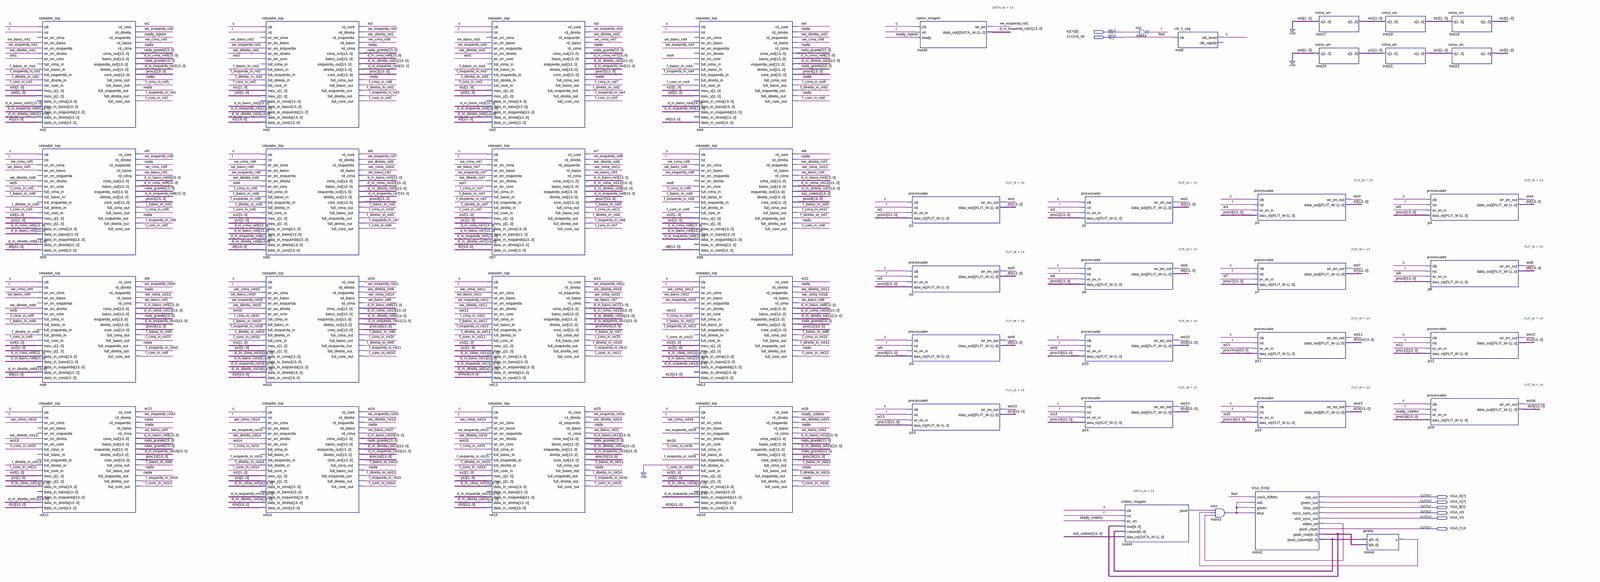
[diagram p0: schematic sheet, whole]
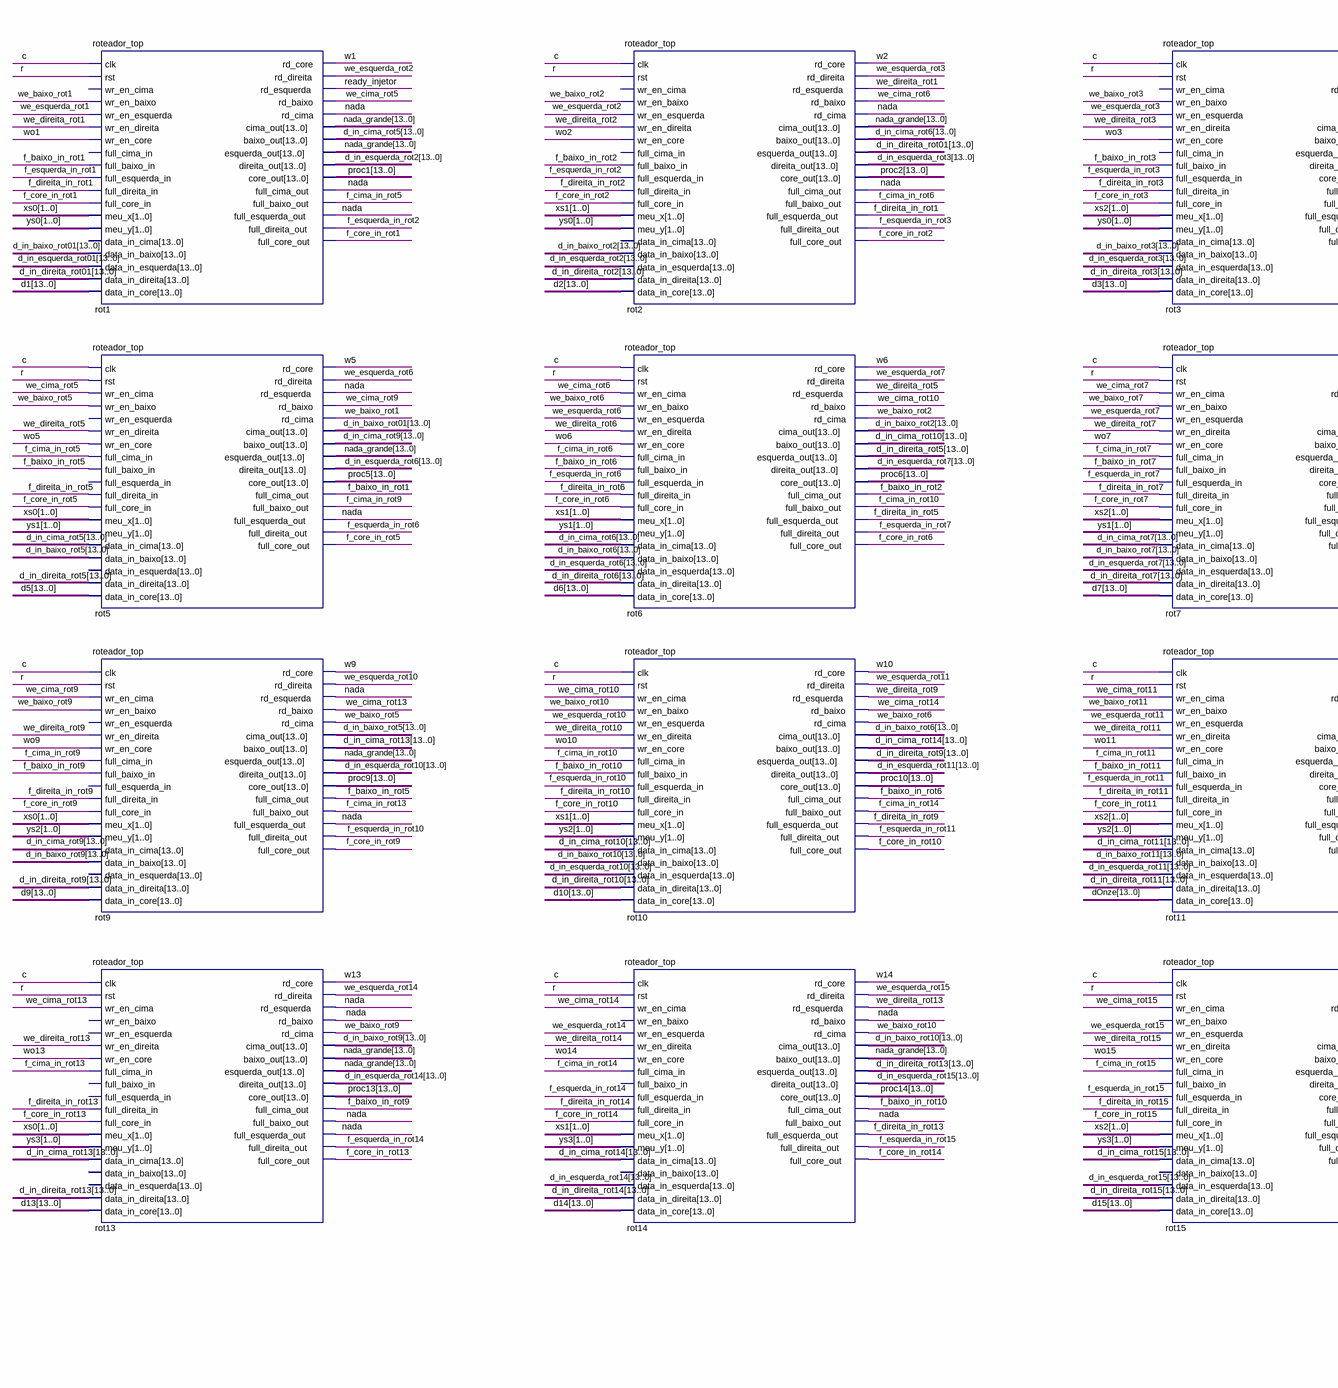
[diagram p1: schematic sheet, left part]
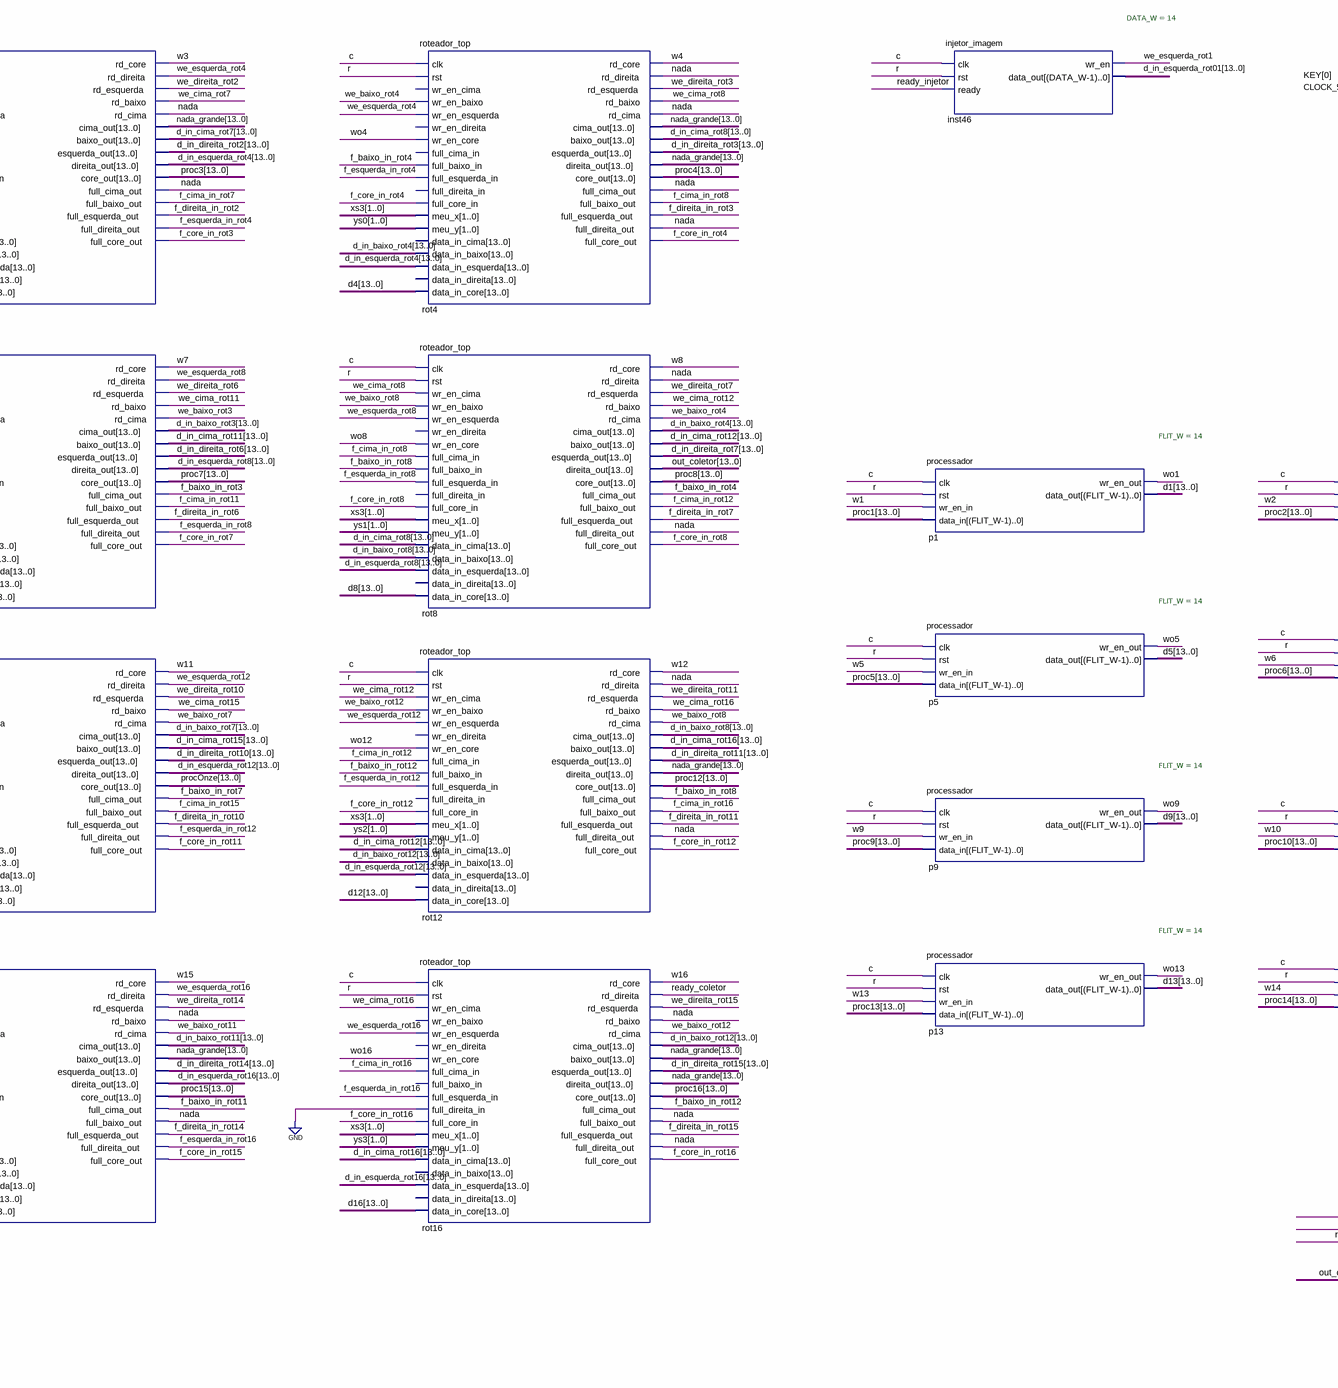
[diagram p2: schematic sheet, centre part]
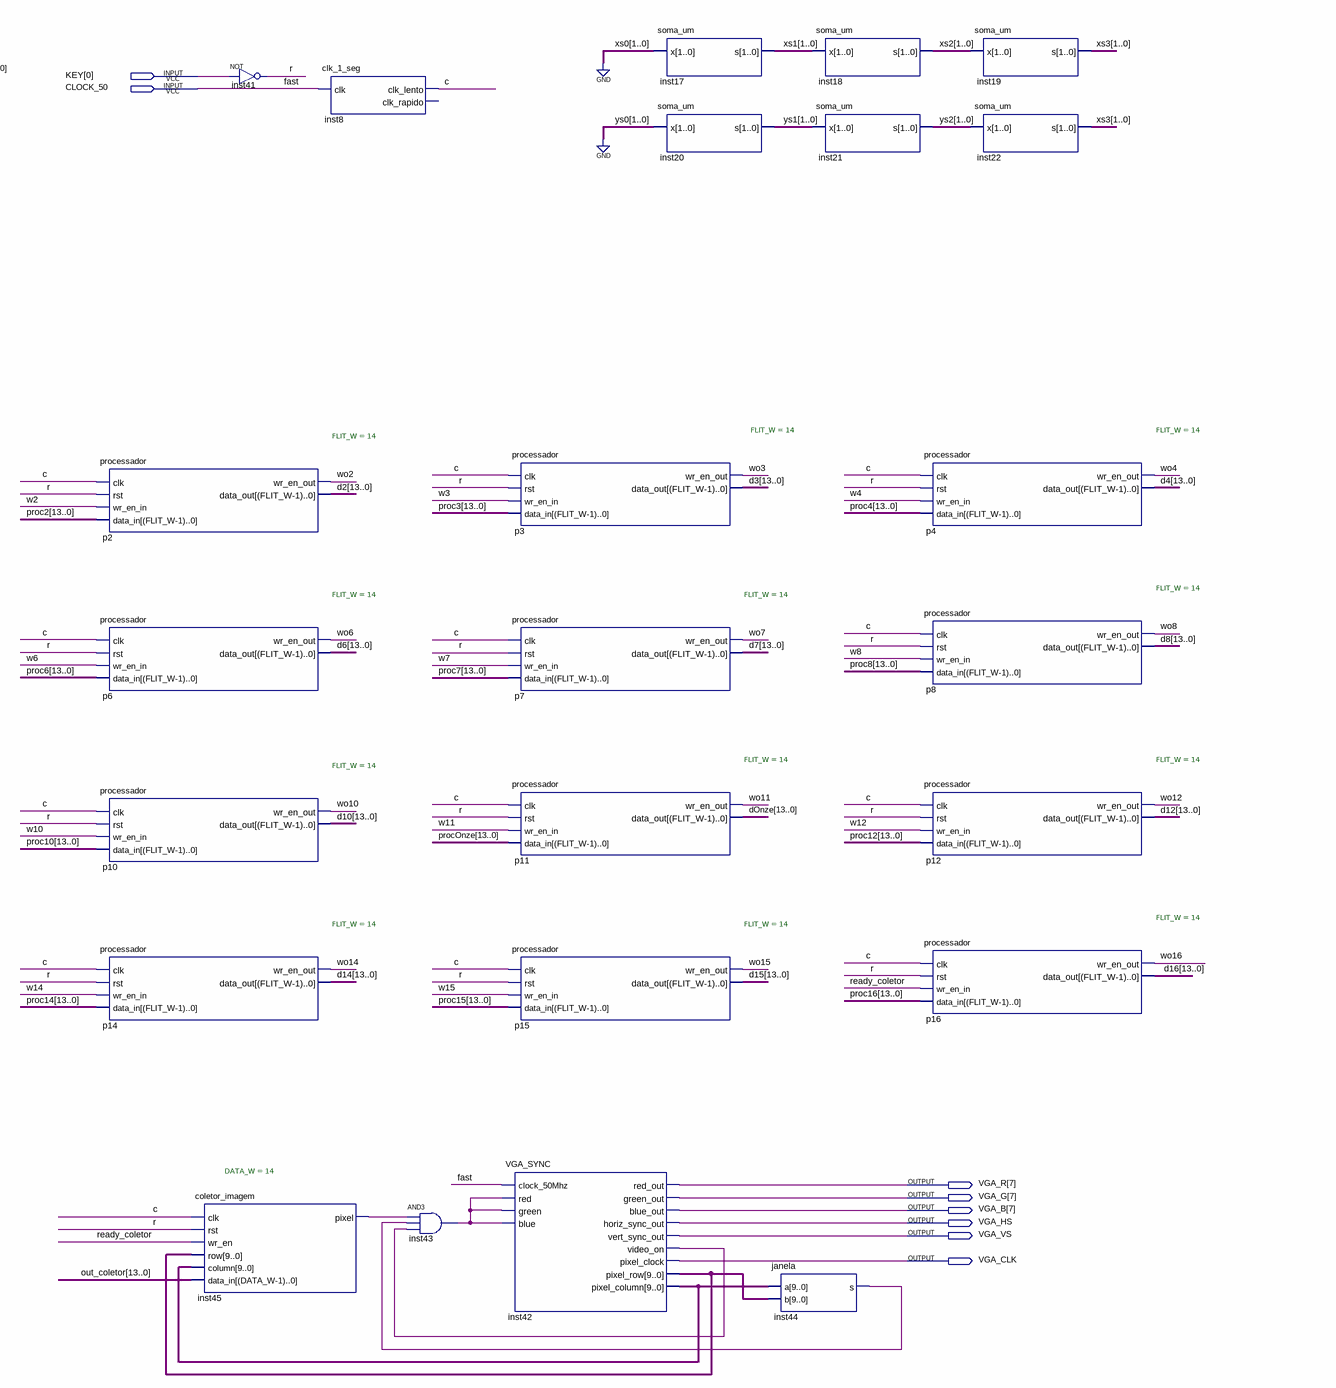
[diagram p3: schematic sheet, right part]
// Quartus schematic pratica05.bdf as structural Verilog: 45 symbols, 8 pins
module pratica05 (
  input  [0:0] KEY,
  input  CLOCK_50,
  output [7:7] VGA_R,
  output [7:7] VGA_G,
  output [7:7] VGA_B,
  output VGA_HS,
  output VGA_VS,
  output VGA_CLK
);

  wire c, f_baixo_in_rot1, f_baixo_in_rot2, f_baixo_in_rot3, f_baixo_in_rot4, f_baixo_in_rot5,
       f_baixo_in_rot6, f_baixo_in_rot7, f_baixo_in_rot8, f_baixo_in_rot9, f_baixo_in_rot10,
       f_baixo_in_rot11, f_baixo_in_rot12, f_cima_in_rot5, f_cima_in_rot6, f_cima_in_rot7, f_cima_in_rot8,
       f_cima_in_rot9, f_cima_in_rot10, f_cima_in_rot11, f_cima_in_rot12, f_cima_in_rot13, f_cima_in_rot14,
       f_cima_in_rot15, f_cima_in_rot16, f_core_in_rot1, f_core_in_rot2, f_core_in_rot3, f_core_in_rot4,
       f_core_in_rot5, f_core_in_rot6, f_core_in_rot7, f_core_in_rot8, f_core_in_rot9, f_core_in_rot10,
       f_core_in_rot11, f_core_in_rot12, f_core_in_rot13, f_core_in_rot14, f_core_in_rot15, f_core_in_rot16,
       f_direita_in_rot1, f_direita_in_rot2, f_direita_in_rot3, f_direita_in_rot5, f_direita_in_rot6,
       f_direita_in_rot7, f_direita_in_rot9, f_direita_in_rot10, f_direita_in_rot11, f_direita_in_rot13,
       f_direita_in_rot14, f_direita_in_rot15, f_esquerda_in_rot1, f_esquerda_in_rot2, f_esquerda_in_rot3,
       f_esquerda_in_rot4, f_esquerda_in_rot6, f_esquerda_in_rot7, f_esquerda_in_rot8, f_esquerda_in_rot10,
       f_esquerda_in_rot11, f_esquerda_in_rot12, f_esquerda_in_rot14, f_esquerda_in_rot15,
       f_esquerda_in_rot16, inst42_video_on, inst43_out, inst44_s, inst45_pixel, nada, r, ready_coletor,
       ready_injetor, w1, w2, w3, w4, w5, w6, w7, w8, w9, w10, w11, w12, w13, w14, w15, w16, we_baixo_rot1,
       we_baixo_rot2, we_baixo_rot3, we_baixo_rot4, we_baixo_rot5, we_baixo_rot6, we_baixo_rot7,
       we_baixo_rot8, we_baixo_rot9, we_baixo_rot10, we_baixo_rot11, we_baixo_rot12, we_cima_rot5,
       we_cima_rot6, we_cima_rot7, we_cima_rot8, we_cima_rot9, we_cima_rot10, we_cima_rot11, we_cima_rot12,
       we_cima_rot13, we_cima_rot14, we_cima_rot15, we_cima_rot16, we_direita_rot1, we_direita_rot2,
       we_direita_rot3, we_direita_rot5, we_direita_rot6, we_direita_rot7, we_direita_rot9, we_direita_rot10,
       we_direita_rot11, we_direita_rot13, we_direita_rot14, we_direita_rot15, we_esquerda_rot1,
       we_esquerda_rot2, we_esquerda_rot3, we_esquerda_rot4, we_esquerda_rot6, we_esquerda_rot7,
       we_esquerda_rot8, we_esquerda_rot10, we_esquerda_rot11, we_esquerda_rot12, we_esquerda_rot14,
       we_esquerda_rot15, we_esquerda_rot16, wo1, wo2, wo3, wo4, wo5, wo6, wo7, wo8, wo9, wo10, wo11, wo12,
       wo13, wo14, wo15, wo16;
  wire [1:0] xs1, xs2, xs3, ys1, ys2, ys3;
  wire [9:0] inst42_pixel_column, inst42_pixel_row;
  wire [13:0] d1, d2, d3, d4, d5, d6, d7, d8, d9, d10, d12, d13, d14, d15, d16, d_in_baixo_rot01,
       d_in_baixo_rot2, d_in_baixo_rot3, d_in_baixo_rot4, d_in_baixo_rot5, d_in_baixo_rot6, d_in_baixo_rot7,
       d_in_baixo_rot8, d_in_baixo_rot9, d_in_baixo_rot10, d_in_baixo_rot11, d_in_baixo_rot12,
       d_in_cima_rot5, d_in_cima_rot6, d_in_cima_rot7, d_in_cima_rot8, d_in_cima_rot9, d_in_cima_rot10,
       d_in_cima_rot11, d_in_cima_rot12, d_in_cima_rot13, d_in_cima_rot14, d_in_cima_rot15, d_in_cima_rot16,
       d_in_direita_rot01, d_in_direita_rot2, d_in_direita_rot3, d_in_direita_rot5, d_in_direita_rot6,
       d_in_direita_rot7, d_in_direita_rot9, d_in_direita_rot10, d_in_direita_rot11, d_in_direita_rot13,
       d_in_direita_rot14, d_in_direita_rot15, d_in_esquerda_rot01, d_in_esquerda_rot2, d_in_esquerda_rot3,
       d_in_esquerda_rot4, d_in_esquerda_rot6, d_in_esquerda_rot7, d_in_esquerda_rot8, d_in_esquerda_rot10,
       d_in_esquerda_rot11, d_in_esquerda_rot12, d_in_esquerda_rot14, d_in_esquerda_rot15,
       d_in_esquerda_rot16, dOnze, nada_grande, out_coletor, proc1, proc2, proc3, proc4, proc5, proc6, proc7,
       proc8, proc9, proc10, proc12, proc13, proc14, proc15, proc16, procOnze;

  roteador_top rot1 (
    .clk(c), .rst(r), .wr_en_baixo(we_baixo_rot1), .wr_en_esquerda(we_esquerda_rot1),
    .wr_en_direita(we_direita_rot1), .wr_en_core(wo1), .full_baixo_in(f_baixo_in_rot1),
    .full_esquerda_in(f_esquerda_in_rot1), .full_direita_in(f_direita_in_rot1),
    .full_core_in(f_core_in_rot1), .meu_x(2'b00), .meu_y(2'b00), .data_in_baixo(d_in_baixo_rot01),
    .data_in_esquerda(d_in_esquerda_rot01), .data_in_direita(d_in_direita_rot01), .data_in_core(d1),
    .rd_core(w1), .rd_direita(we_esquerda_rot2), .rd_esquerda(ready_injetor), .rd_baixo(we_cima_rot5),
    .rd_cima(nada), .cima_out(nada_grande), .baixo_out(d_in_cima_rot5), .esquerda_out(nada_grande),
    .direita_out(d_in_esquerda_rot2), .core_out(proc1), .full_cima_out(nada),
    .full_baixo_out(f_cima_in_rot5), .full_esquerda_out(nada), .full_direita_out(f_esquerda_in_rot2),
    .full_core_out(f_core_in_rot1));  // open: wr_en_cima, full_cima_in, data_in_cima
  roteador_top rot5 (
    .clk(c), .rst(r), .wr_en_cima(we_cima_rot5), .wr_en_baixo(we_baixo_rot5),
    .wr_en_direita(we_direita_rot5), .wr_en_core(wo5), .full_cima_in(f_cima_in_rot5),
    .full_baixo_in(f_baixo_in_rot5), .full_direita_in(f_direita_in_rot5), .full_core_in(f_core_in_rot5),
    .meu_x(2'b00), .meu_y(ys1), .data_in_cima(d_in_cima_rot5), .data_in_baixo(d_in_baixo_rot5),
    .data_in_direita(d_in_direita_rot5), .data_in_core(d5), .rd_core(w5), .rd_direita(we_esquerda_rot6),
    .rd_esquerda(nada), .rd_baixo(we_cima_rot9), .rd_cima(we_baixo_rot1), .cima_out(d_in_baixo_rot01),
    .baixo_out(d_in_cima_rot9), .esquerda_out(nada_grande), .direita_out(d_in_esquerda_rot6),
    .core_out(proc5), .full_cima_out(f_baixo_in_rot1), .full_baixo_out(f_cima_in_rot9),
    .full_esquerda_out(nada), .full_direita_out(f_esquerda_in_rot6), .full_core_out(f_core_in_rot5));  // open: wr_en_esquerda, full_esquerda_in, data_in_esquerda
  roteador_top rot9 (
    .clk(c), .rst(r), .wr_en_cima(we_cima_rot9), .wr_en_baixo(we_baixo_rot9),
    .wr_en_direita(we_direita_rot9), .wr_en_core(wo9), .full_cima_in(f_cima_in_rot9),
    .full_baixo_in(f_baixo_in_rot9), .full_direita_in(f_direita_in_rot9), .full_core_in(f_core_in_rot9),
    .meu_x(2'b00), .meu_y(ys2), .data_in_cima(d_in_cima_rot9), .data_in_baixo(d_in_baixo_rot9),
    .data_in_direita(d_in_direita_rot9), .data_in_core(d9), .rd_core(w9), .rd_direita(we_esquerda_rot10),
    .rd_esquerda(nada), .rd_baixo(we_cima_rot13), .rd_cima(we_baixo_rot5), .cima_out(d_in_baixo_rot5),
    .baixo_out(d_in_cima_rot13), .esquerda_out(nada_grande), .direita_out(d_in_esquerda_rot10),
    .core_out(proc9), .full_cima_out(f_baixo_in_rot5), .full_baixo_out(f_cima_in_rot13),
    .full_esquerda_out(nada), .full_direita_out(f_esquerda_in_rot10), .full_core_out(f_core_in_rot9));  // open: wr_en_esquerda, full_esquerda_in, data_in_esquerda
  roteador_top rot13 (
    .clk(c), .rst(r), .wr_en_cima(we_cima_rot13), .wr_en_direita(we_direita_rot13), .wr_en_core(wo13),
    .full_cima_in(f_cima_in_rot13), .full_direita_in(f_direita_in_rot13), .full_core_in(f_core_in_rot13),
    .meu_x(2'b00), .meu_y(ys3), .data_in_cima(d_in_cima_rot13), .data_in_direita(d_in_direita_rot13),
    .data_in_core(d13), .rd_core(w13), .rd_direita(we_esquerda_rot14), .rd_esquerda(nada), .rd_baixo(nada),
    .rd_cima(we_baixo_rot9), .cima_out(d_in_baixo_rot9), .baixo_out(nada_grande), .esquerda_out(nada_grande),
    .direita_out(d_in_esquerda_rot14), .core_out(proc13), .full_cima_out(f_baixo_in_rot9),
    .full_baixo_out(nada), .full_esquerda_out(nada), .full_direita_out(f_esquerda_in_rot14),
    .full_core_out(f_core_in_rot13));  // open: wr_en_baixo, wr_en_esquerda, full_baixo_in, full_esquerda_in, data_in_baixo, data_in_esquerda
  roteador_top rot2 (
    .clk(c), .rst(r), .wr_en_baixo(we_baixo_rot2), .wr_en_esquerda(we_esquerda_rot2),
    .wr_en_direita(we_direita_rot2), .wr_en_core(wo2), .full_baixo_in(f_baixo_in_rot2),
    .full_esquerda_in(f_esquerda_in_rot2), .full_direita_in(f_direita_in_rot2),
    .full_core_in(f_core_in_rot2), .meu_x(xs1), .meu_y(2'b00), .data_in_baixo(d_in_baixo_rot2),
    .data_in_esquerda(d_in_esquerda_rot2), .data_in_direita(d_in_direita_rot2), .data_in_core(d2),
    .rd_core(w2), .rd_direita(we_esquerda_rot3), .rd_esquerda(we_direita_rot1), .rd_baixo(we_cima_rot6),
    .rd_cima(nada), .cima_out(nada_grande), .baixo_out(d_in_cima_rot6), .esquerda_out(d_in_direita_rot01),
    .direita_out(d_in_esquerda_rot3), .core_out(proc2), .full_cima_out(nada),
    .full_baixo_out(f_cima_in_rot6), .full_esquerda_out(f_direita_in_rot1),
    .full_direita_out(f_esquerda_in_rot3), .full_core_out(f_core_in_rot2));  // open: wr_en_cima, full_cima_in, data_in_cima
  roteador_top rot6 (
    .clk(c), .rst(r), .wr_en_cima(we_cima_rot6), .wr_en_baixo(we_baixo_rot6),
    .wr_en_esquerda(we_esquerda_rot6), .wr_en_direita(we_direita_rot6), .wr_en_core(wo6),
    .full_cima_in(f_cima_in_rot6), .full_baixo_in(f_baixo_in_rot6), .full_esquerda_in(f_esquerda_in_rot6),
    .full_direita_in(f_direita_in_rot6), .full_core_in(f_core_in_rot6), .meu_x(xs1), .meu_y(ys1),
    .data_in_cima(d_in_cima_rot6), .data_in_baixo(d_in_baixo_rot6), .data_in_esquerda(d_in_esquerda_rot6),
    .data_in_direita(d_in_direita_rot6), .data_in_core(d6), .rd_core(w6), .rd_direita(we_esquerda_rot7),
    .rd_esquerda(we_direita_rot5), .rd_baixo(we_cima_rot10), .rd_cima(we_baixo_rot2),
    .cima_out(d_in_baixo_rot2), .baixo_out(d_in_cima_rot10), .esquerda_out(d_in_direita_rot5),
    .direita_out(d_in_esquerda_rot7), .core_out(proc6), .full_cima_out(f_baixo_in_rot2),
    .full_baixo_out(f_cima_in_rot10), .full_esquerda_out(f_direita_in_rot5),
    .full_direita_out(f_esquerda_in_rot7), .full_core_out(f_core_in_rot6));
  roteador_top rot10 (
    .clk(c), .rst(r), .wr_en_cima(we_cima_rot10), .wr_en_baixo(we_baixo_rot10),
    .wr_en_esquerda(we_esquerda_rot10), .wr_en_direita(we_direita_rot10), .wr_en_core(wo10),
    .full_cima_in(f_cima_in_rot10), .full_baixo_in(f_baixo_in_rot10), .full_esquerda_in(f_esquerda_in_rot10),
    .full_direita_in(f_direita_in_rot10), .full_core_in(f_core_in_rot10), .meu_x(xs1), .meu_y(ys2),
    .data_in_cima(d_in_cima_rot10), .data_in_baixo(d_in_baixo_rot10), .data_in_esquerda(d_in_esquerda_rot10),
    .data_in_direita(d_in_direita_rot10), .data_in_core(d10), .rd_core(w10), .rd_direita(we_esquerda_rot11),
    .rd_esquerda(we_direita_rot9), .rd_baixo(we_cima_rot14), .rd_cima(we_baixo_rot6),
    .cima_out(d_in_baixo_rot6), .baixo_out(d_in_cima_rot14), .esquerda_out(d_in_direita_rot9),
    .direita_out(d_in_esquerda_rot11), .core_out(proc10), .full_cima_out(f_baixo_in_rot6),
    .full_baixo_out(f_cima_in_rot14), .full_esquerda_out(f_direita_in_rot9),
    .full_direita_out(f_esquerda_in_rot11), .full_core_out(f_core_in_rot10));
  roteador_top rot14 (
    .clk(c), .rst(r), .wr_en_cima(we_cima_rot14), .wr_en_esquerda(we_esquerda_rot14),
    .wr_en_direita(we_direita_rot14), .wr_en_core(wo14), .full_cima_in(f_cima_in_rot14),
    .full_esquerda_in(f_esquerda_in_rot14), .full_direita_in(f_direita_in_rot14),
    .full_core_in(f_core_in_rot14), .meu_x(xs1), .meu_y(ys3), .data_in_cima(d_in_cima_rot14),
    .data_in_esquerda(d_in_esquerda_rot14), .data_in_direita(d_in_direita_rot14), .data_in_core(d14),
    .rd_core(w14), .rd_direita(we_esquerda_rot15), .rd_esquerda(we_direita_rot13), .rd_baixo(nada),
    .rd_cima(we_baixo_rot10), .cima_out(d_in_baixo_rot10), .baixo_out(nada_grande),
    .esquerda_out(d_in_direita_rot13), .direita_out(d_in_esquerda_rot15), .core_out(proc14),
    .full_cima_out(f_baixo_in_rot10), .full_baixo_out(nada), .full_esquerda_out(f_direita_in_rot13),
    .full_direita_out(f_esquerda_in_rot15), .full_core_out(f_core_in_rot14));  // open: wr_en_baixo, full_baixo_in, data_in_baixo
  roteador_top rot3 (
    .clk(c), .rst(r), .wr_en_baixo(we_baixo_rot3), .wr_en_esquerda(we_esquerda_rot3),
    .wr_en_direita(we_direita_rot3), .wr_en_core(wo3), .full_baixo_in(f_baixo_in_rot3),
    .full_esquerda_in(f_esquerda_in_rot3), .full_direita_in(f_direita_in_rot3),
    .full_core_in(f_core_in_rot3), .meu_x(xs2), .meu_y(2'b00), .data_in_baixo(d_in_baixo_rot3),
    .data_in_esquerda(d_in_esquerda_rot3), .data_in_direita(d_in_direita_rot3), .data_in_core(d3),
    .rd_core(w3), .rd_direita(we_esquerda_rot4), .rd_esquerda(we_direita_rot2), .rd_baixo(we_cima_rot7),
    .rd_cima(nada), .cima_out(nada_grande), .baixo_out(d_in_cima_rot7), .esquerda_out(d_in_direita_rot2),
    .direita_out(d_in_esquerda_rot4), .core_out(proc3), .full_cima_out(nada),
    .full_baixo_out(f_cima_in_rot7), .full_esquerda_out(f_direita_in_rot2),
    .full_direita_out(f_esquerda_in_rot4), .full_core_out(f_core_in_rot3));  // open: wr_en_cima, full_cima_in, data_in_cima
  roteador_top rot7 (
    .clk(c), .rst(r), .wr_en_cima(we_cima_rot7), .wr_en_baixo(we_baixo_rot7),
    .wr_en_esquerda(we_esquerda_rot7), .wr_en_direita(we_direita_rot7), .wr_en_core(wo7),
    .full_cima_in(f_cima_in_rot7), .full_baixo_in(f_baixo_in_rot7), .full_esquerda_in(f_esquerda_in_rot7),
    .full_direita_in(f_direita_in_rot7), .full_core_in(f_core_in_rot7), .meu_x(xs2), .meu_y(ys1),
    .data_in_cima(d_in_cima_rot7), .data_in_baixo(d_in_baixo_rot7), .data_in_esquerda(d_in_esquerda_rot7),
    .data_in_direita(d_in_direita_rot7), .data_in_core(d7), .rd_core(w7), .rd_direita(we_esquerda_rot8),
    .rd_esquerda(we_direita_rot6), .rd_baixo(we_cima_rot11), .rd_cima(we_baixo_rot3),
    .cima_out(d_in_baixo_rot3), .baixo_out(d_in_cima_rot11), .esquerda_out(d_in_direita_rot6),
    .direita_out(d_in_esquerda_rot8), .core_out(proc7), .full_cima_out(f_baixo_in_rot3),
    .full_baixo_out(f_cima_in_rot11), .full_esquerda_out(f_direita_in_rot6),
    .full_direita_out(f_esquerda_in_rot8), .full_core_out(f_core_in_rot7));
  roteador_top rot11 (
    .clk(c), .rst(r), .wr_en_cima(we_cima_rot11), .wr_en_baixo(we_baixo_rot11),
    .wr_en_esquerda(we_esquerda_rot11), .wr_en_direita(we_direita_rot11), .wr_en_core(wo11),
    .full_cima_in(f_cima_in_rot11), .full_baixo_in(f_baixo_in_rot11), .full_esquerda_in(f_esquerda_in_rot11),
    .full_direita_in(f_direita_in_rot11), .full_core_in(f_core_in_rot11), .meu_x(xs2), .meu_y(ys2),
    .data_in_cima(d_in_cima_rot11), .data_in_baixo(d_in_baixo_rot11), .data_in_esquerda(d_in_esquerda_rot11),
    .data_in_direita(d_in_direita_rot11), .data_in_core(dOnze), .rd_core(w11),
    .rd_direita(we_esquerda_rot12), .rd_esquerda(we_direita_rot10), .rd_baixo(we_cima_rot15),
    .rd_cima(we_baixo_rot7), .cima_out(d_in_baixo_rot7), .baixo_out(d_in_cima_rot15),
    .esquerda_out(d_in_direita_rot10), .direita_out(d_in_esquerda_rot12), .core_out(procOnze),
    .full_cima_out(f_baixo_in_rot7), .full_baixo_out(f_cima_in_rot15),
    .full_esquerda_out(f_direita_in_rot10), .full_direita_out(f_esquerda_in_rot12),
    .full_core_out(f_core_in_rot11));
  roteador_top rot15 (
    .clk(c), .rst(r), .wr_en_cima(we_cima_rot15), .wr_en_esquerda(we_esquerda_rot15),
    .wr_en_direita(we_direita_rot15), .wr_en_core(wo15), .full_cima_in(f_cima_in_rot15),
    .full_esquerda_in(f_esquerda_in_rot15), .full_direita_in(f_direita_in_rot15),
    .full_core_in(f_core_in_rot15), .meu_x(xs2), .meu_y(ys3), .data_in_cima(d_in_cima_rot15),
    .data_in_esquerda(d_in_esquerda_rot15), .data_in_direita(d_in_direita_rot15), .data_in_core(d15),
    .rd_core(w15), .rd_direita(we_esquerda_rot16), .rd_esquerda(we_direita_rot14), .rd_baixo(nada),
    .rd_cima(we_baixo_rot11), .cima_out(d_in_baixo_rot11), .baixo_out(nada_grande),
    .esquerda_out(d_in_direita_rot14), .direita_out(d_in_esquerda_rot16), .core_out(proc15),
    .full_cima_out(f_baixo_in_rot11), .full_baixo_out(nada), .full_esquerda_out(f_direita_in_rot14),
    .full_direita_out(f_esquerda_in_rot16), .full_core_out(f_core_in_rot15));  // open: wr_en_baixo, full_baixo_in, data_in_baixo
  roteador_top rot4 (
    .clk(c), .rst(r), .wr_en_baixo(we_baixo_rot4), .wr_en_esquerda(we_esquerda_rot4), .wr_en_core(wo4),
    .full_baixo_in(f_baixo_in_rot4), .full_esquerda_in(f_esquerda_in_rot4), .full_core_in(f_core_in_rot4),
    .meu_x(xs3), .meu_y(2'b00), .data_in_baixo(d_in_baixo_rot4), .data_in_esquerda(d_in_esquerda_rot4),
    .data_in_core(d4), .rd_core(w4), .rd_direita(nada), .rd_esquerda(we_direita_rot3),
    .rd_baixo(we_cima_rot8), .rd_cima(nada), .cima_out(nada_grande), .baixo_out(d_in_cima_rot8),
    .esquerda_out(d_in_direita_rot3), .direita_out(nada_grande), .core_out(proc4), .full_cima_out(nada),
    .full_baixo_out(f_cima_in_rot8), .full_esquerda_out(f_direita_in_rot3), .full_direita_out(nada),
    .full_core_out(f_core_in_rot4));  // open: wr_en_cima, wr_en_direita, full_cima_in, full_direita_in, data_in_cima, data_in_direita
  roteador_top rot8 (
    .clk(c), .rst(r), .wr_en_cima(we_cima_rot8), .wr_en_baixo(we_baixo_rot8),
    .wr_en_esquerda(we_esquerda_rot8), .wr_en_core(wo8), .full_cima_in(f_cima_in_rot8),
    .full_baixo_in(f_baixo_in_rot8), .full_esquerda_in(f_esquerda_in_rot8), .full_core_in(f_core_in_rot8),
    .meu_x(xs3), .meu_y(ys1), .data_in_cima(d_in_cima_rot8), .data_in_baixo(d_in_baixo_rot8),
    .data_in_esquerda(d_in_esquerda_rot8), .data_in_core(d8), .rd_core(w8), .rd_direita(nada),
    .rd_esquerda(we_direita_rot7), .rd_baixo(we_cima_rot12), .rd_cima(we_baixo_rot4),
    .cima_out(d_in_baixo_rot4), .baixo_out(d_in_cima_rot12), .esquerda_out(d_in_direita_rot7),
    .direita_out(out_coletor), .core_out(proc8), .full_cima_out(f_baixo_in_rot4),
    .full_baixo_out(f_cima_in_rot12), .full_esquerda_out(f_direita_in_rot7), .full_direita_out(nada),
    .full_core_out(f_core_in_rot8));  // open: wr_en_direita, full_direita_in, data_in_direita
  roteador_top rot12 (
    .clk(c), .rst(r), .wr_en_cima(we_cima_rot12), .wr_en_baixo(we_baixo_rot12),
    .wr_en_esquerda(we_esquerda_rot12), .wr_en_core(wo12), .full_cima_in(f_cima_in_rot12),
    .full_baixo_in(f_baixo_in_rot12), .full_esquerda_in(f_esquerda_in_rot12), .full_core_in(f_core_in_rot12),
    .meu_x(xs3), .meu_y(ys2), .data_in_cima(d_in_cima_rot12), .data_in_baixo(d_in_baixo_rot12),
    .data_in_esquerda(d_in_esquerda_rot12), .data_in_core(d12), .rd_core(w12), .rd_direita(nada),
    .rd_esquerda(we_direita_rot11), .rd_baixo(we_cima_rot16), .rd_cima(we_baixo_rot8),
    .cima_out(d_in_baixo_rot8), .baixo_out(d_in_cima_rot16), .esquerda_out(d_in_direita_rot11),
    .direita_out(nada_grande), .core_out(proc12), .full_cima_out(f_baixo_in_rot8),
    .full_baixo_out(f_cima_in_rot16), .full_esquerda_out(f_direita_in_rot11), .full_direita_out(nada),
    .full_core_out(f_core_in_rot12));  // open: wr_en_direita, full_direita_in, data_in_direita
  roteador_top rot16 (
    .clk(c), .rst(r), .wr_en_cima(we_cima_rot16), .wr_en_esquerda(we_esquerda_rot16), .wr_en_core(wo16),
    .full_cima_in(f_cima_in_rot16), .full_esquerda_in(f_esquerda_in_rot16), .full_direita_in(1'b0),
    .full_core_in(f_core_in_rot16), .meu_x(xs3), .meu_y(ys3), .data_in_cima(d_in_cima_rot16),
    .data_in_esquerda(d_in_esquerda_rot16), .data_in_core(d16), .rd_core(w16), .rd_direita(ready_coletor),
    .rd_esquerda(we_direita_rot15), .rd_baixo(nada), .rd_cima(we_baixo_rot12), .cima_out(d_in_baixo_rot12),
    .baixo_out(nada_grande), .esquerda_out(d_in_direita_rot15), .direita_out(nada_grande), .core_out(proc16),
    .full_cima_out(f_baixo_in_rot12), .full_baixo_out(nada), .full_esquerda_out(f_direita_in_rot15),
    .full_direita_out(nada), .full_core_out(f_core_in_rot16));  // open: wr_en_baixo, wr_en_direita, full_baixo_in, data_in_baixo, data_in_direita
  injetor_imagem #(.DATA_W(14)) inst46 (
    .clk(c), .rst(r), .ready(ready_injetor), .wr_en(we_esquerda_rot1), .data_out(d_in_esquerda_rot01));
  processador #(.FLIT_W(14)) p1 (.clk(c), .rst(r), .wr_en_in(w1), .data_in(proc1), .wr_en_out(wo1), .data_out(d1));
  processador #(.FLIT_W(14)) p5 (.clk(c), .rst(r), .wr_en_in(w5), .data_in(proc5), .wr_en_out(wo5), .data_out(d5));
  processador #(.FLIT_W(14)) p9 (.clk(c), .rst(r), .wr_en_in(w9), .data_in(proc9), .wr_en_out(wo9), .data_out(d9));
  processador #(.FLIT_W(14)) p13 (.clk(c), .rst(r), .wr_en_in(w13), .data_in(proc13), .wr_en_out(wo13), .data_out(d13));
  processador #(.FLIT_W(14)) p2 (.clk(c), .rst(r), .wr_en_in(w2), .data_in(proc2), .wr_en_out(wo2), .data_out(d2));
  processador #(.FLIT_W(14)) p6 (.clk(c), .rst(r), .wr_en_in(w6), .data_in(proc6), .wr_en_out(wo6), .data_out(d6));
  processador #(.FLIT_W(14)) p10 (.clk(c), .rst(r), .wr_en_in(w10), .data_in(proc10), .wr_en_out(wo10), .data_out(d10));
  processador #(.FLIT_W(14)) p14 (.clk(c), .rst(r), .wr_en_in(w14), .data_in(proc14), .wr_en_out(wo14), .data_out(d14));
  coletor_imagem #(.DATA_W(14)) inst45 (
    .clk(c), .rst(r), .wr_en(ready_coletor), .row(inst42_pixel_row), .column(inst42_pixel_column),
    .data_in(out_coletor), .pixel(inst45_pixel));
  not inst41 (r, KEY[0]);
  clk_1_seg inst8 (.clk(CLOCK_50), .clk_lento(c));  // open: clk_rapido
  and inst43 (inst43_out, inst45_pixel, inst44_s, inst42_video_on);
  processador #(.FLIT_W(14)) p3 (.clk(c), .rst(r), .wr_en_in(w3), .data_in(proc3), .wr_en_out(wo3), .data_out(d3));
  processador #(.FLIT_W(14)) p7 (.clk(c), .rst(r), .wr_en_in(w7), .data_in(proc7), .wr_en_out(wo7), .data_out(d7));
  processador #(.FLIT_W(14)) p11 (
    .clk(c), .rst(r), .wr_en_in(w11), .data_in(procOnze), .wr_en_out(wo11), .data_out(dOnze));
  processador #(.FLIT_W(14)) p15 (.clk(c), .rst(r), .wr_en_in(w15), .data_in(proc15), .wr_en_out(wo15), .data_out(d15));
  VGA_SYNC inst42 (
    .clock_50Mhz(CLOCK_50), .red(inst43_out), .green(inst43_out), .blue(inst43_out), .red_out(VGA_R[7]),
    .green_out(VGA_G[7]), .blue_out(VGA_B[7]), .horiz_sync_out(VGA_HS), .vert_sync_out(VGA_VS),
    .video_on(inst42_video_on), .pixel_clock(VGA_CLK), .pixel_row(inst42_pixel_row),
    .pixel_column(inst42_pixel_column));
  soma_um inst17 (.x(2'b00), .s(xs1));
  soma_um inst20 (.x(2'b00), .s(ys1));
  janela inst44 (.a(inst42_pixel_column), .b(inst42_pixel_row), .s(inst44_s));
  soma_um inst18 (.x(xs1), .s(xs2));
  soma_um inst21 (.x(ys1), .s(ys2));
  processador #(.FLIT_W(14)) p4 (.clk(c), .rst(r), .wr_en_in(w4), .data_in(proc4), .wr_en_out(wo4), .data_out(d4));
  processador #(.FLIT_W(14)) p8 (.clk(c), .rst(r), .wr_en_in(w8), .data_in(proc8), .wr_en_out(wo8), .data_out(d8));
  processador #(.FLIT_W(14)) p12 (.clk(c), .rst(r), .wr_en_in(w12), .data_in(proc12), .wr_en_out(wo12), .data_out(d12));
  processador #(.FLIT_W(14)) p16 (
    .clk(c), .rst(r), .wr_en_in(ready_coletor), .data_in(proc16), .wr_en_out(wo16), .data_out(d16));
  soma_um inst19 (.x(xs2), .s(xs3));
  soma_um inst22 (.x(ys2), .s(xs3));

  // Other names for the same wires on the sheet: fast = CLOCK_50
endmodule
